# EAGLE design pcb-pick-plaz-guide (EAGLE 9.6.2)
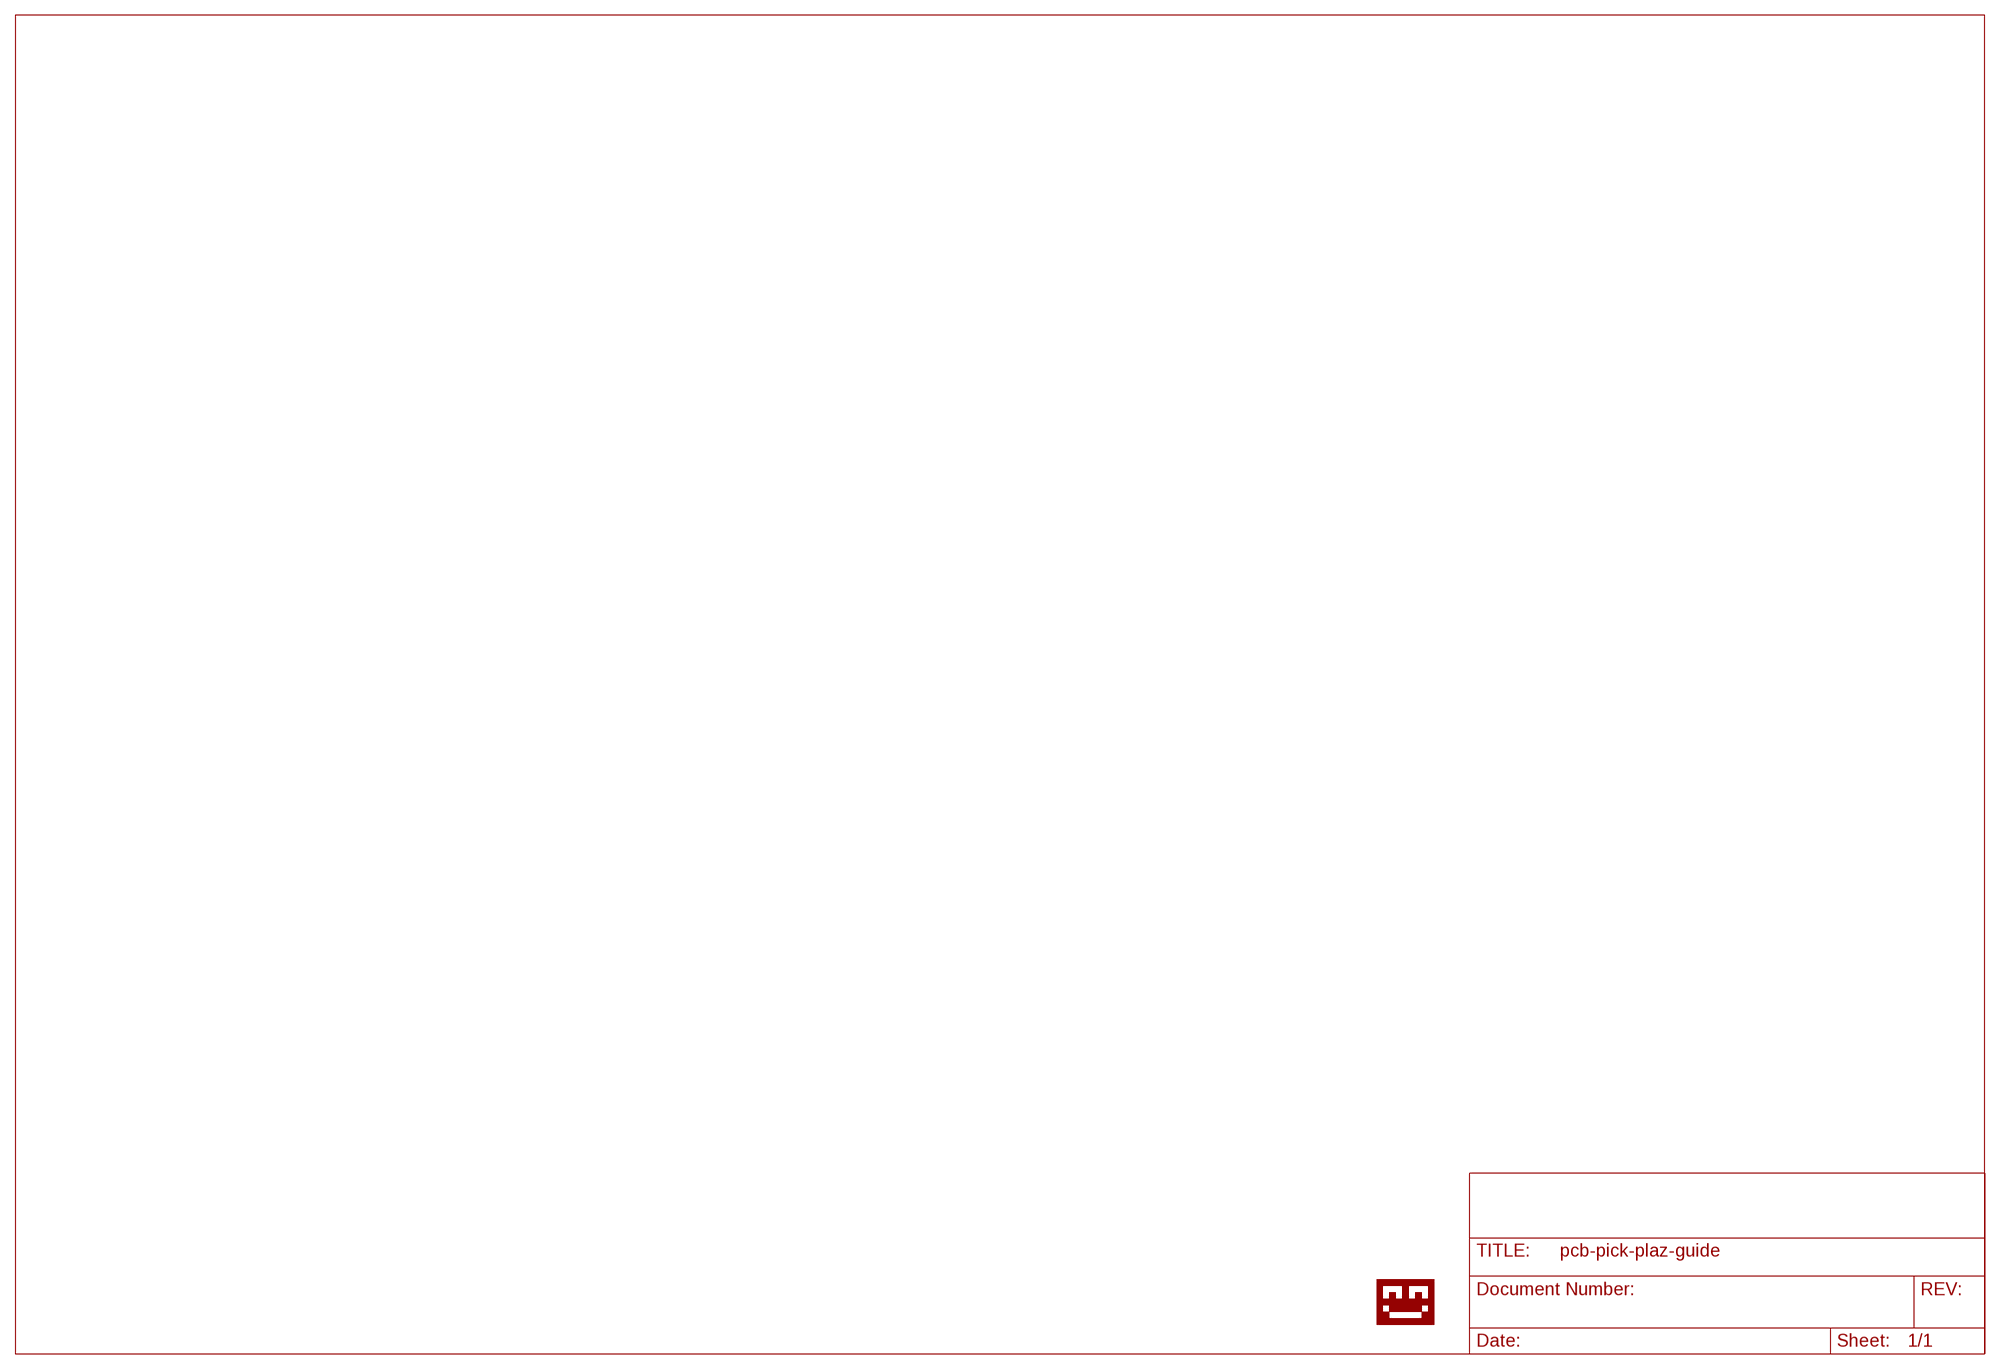
[diagram p0: schematic, sheet 1]

## Parts
U$1  LOGO-TOBENG-1MM  [TOBENG-1MM]

## Library data of the parts
U$1 = ftobler:LOGO

## Board
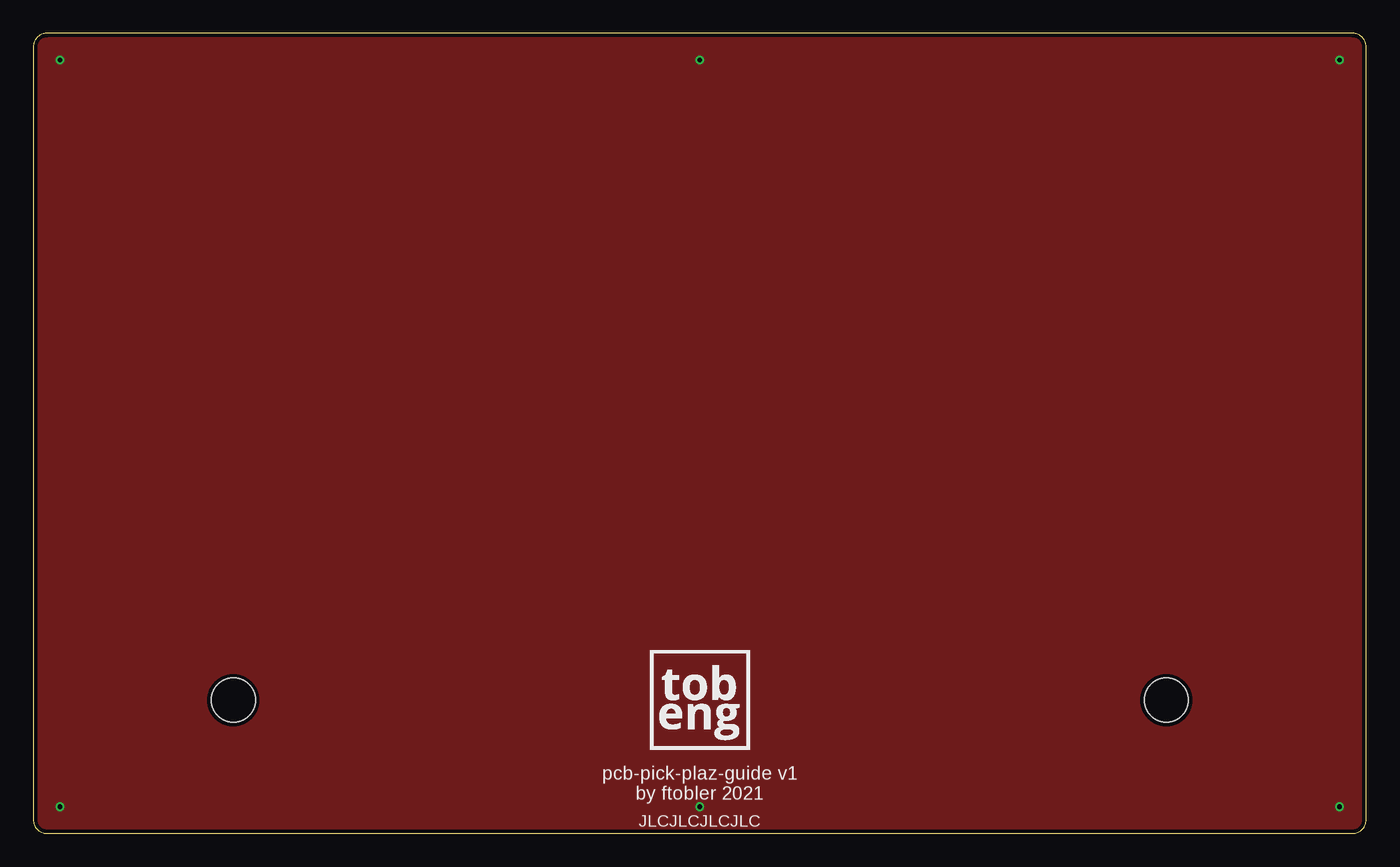
[diagram p1: board, top side]
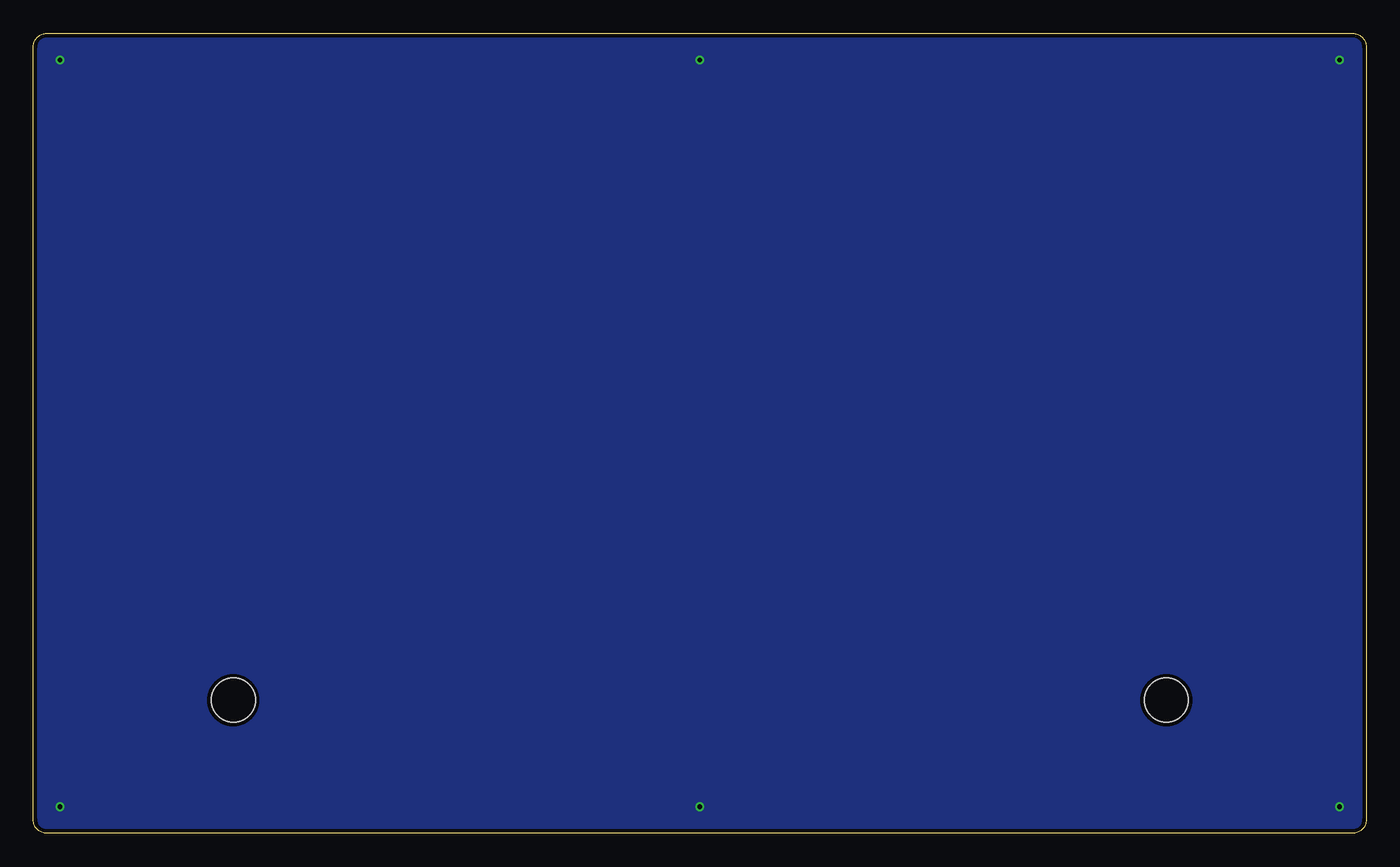
[diagram p2: board, bottom side, seen from below]

Size 100 x 60 mm. Coordinates in mm from the lower left corner, seen from the top.
Outline: 0,59 0,1 arc90 1,0 99,0 arc90 100,1 100,59 arc90 99,60 1,60 arc90 0,59
Copper layers (1*16): Top 0.035mm / dielectric 1.5mm / Bottom 0.035mm
Design rules "default *": minimum track width 0.2mm, minimum drill 0.3mm, track to track 0.2mm, track to pad 0.2mm, pad to pad 0.2mm, via to via 0.2mm, smd to smd 0.2mm, copper to edge 0.3mm, drill to drill 10mil, minimum pad ring 0.15mm, minimum via ring 0.15mm, stop-mask expansion 0.05mm, vias tented up to drill 0.35mm, thermal gap 0.2mm
Holes 3.3 mm at 15,10 85,10

### Placement (x,y rotation side)
U$1  50,10 0 top

### Tracks (layer width: path | path; a pad name or v marks a point on that pad's centre or on a via)
GND  (via drill 0.35)
  other vias: 2,2 2,58 98,58 98,2 50,2 50,58
  pour Top: -4,62 104,62 104,-2 -4,-2
  pour Bottom: -2,64 102,64 102,-4 -2,-4

### Text on the board
tNames: pcb-pick-plaz-guide v1 / by ftobler 2021 | JLCJLCJLCJLC